# EAGLE design led_driver_3A_flat (EAGLE 6.4)
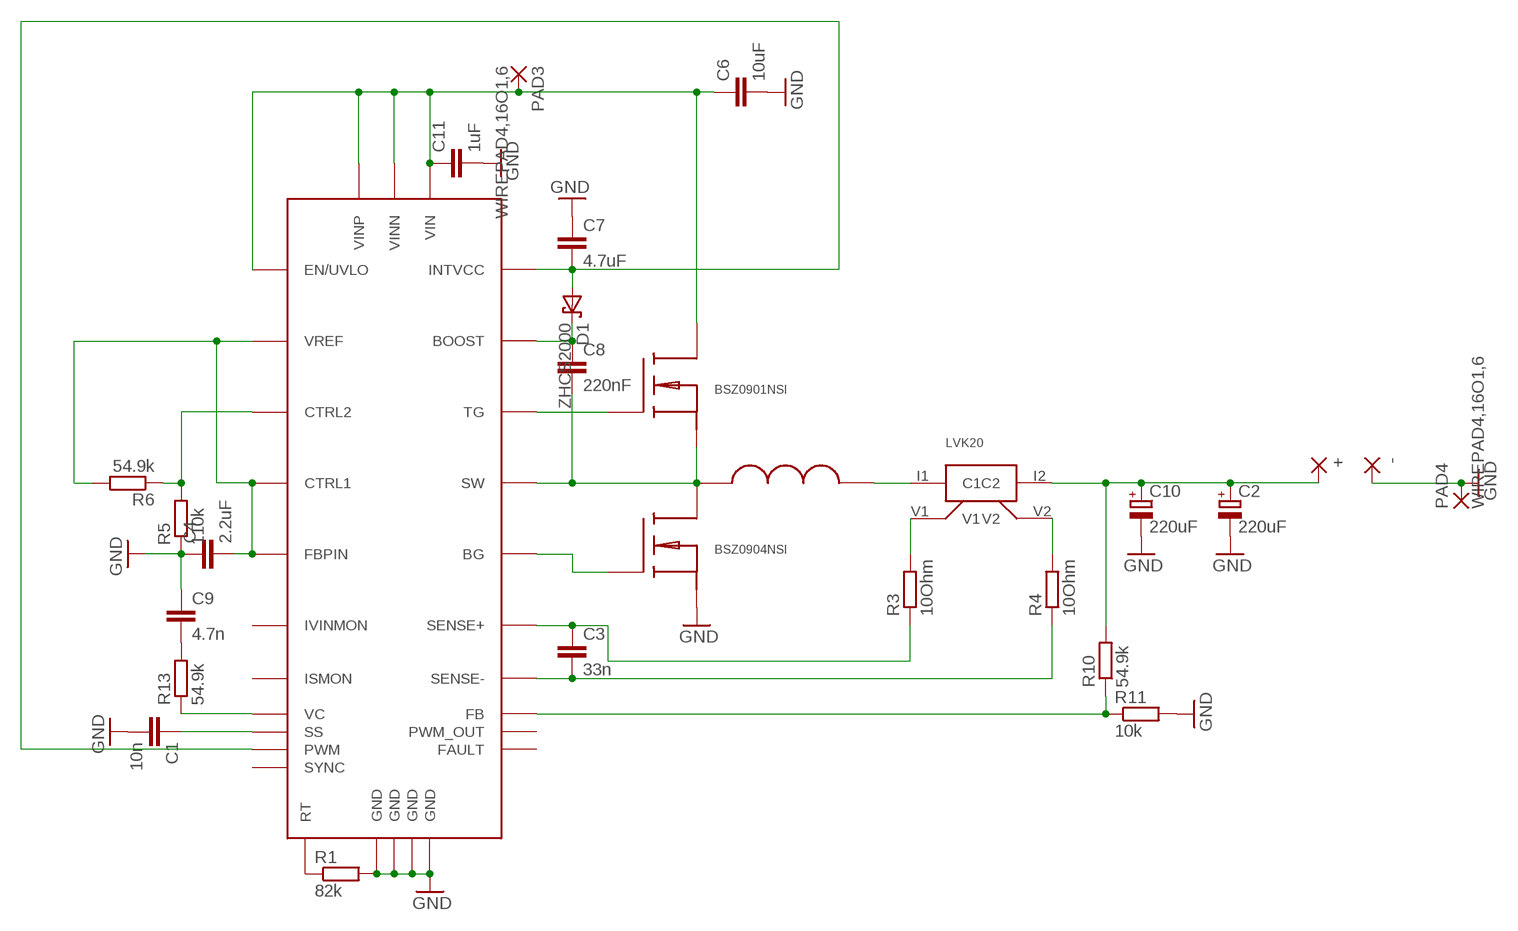
[diagram p0: schematic, sheet 1]

## Parts
+  2,15/1,0  [2,15/1,0]
-  2,15/1,0  [2,15/1,0]
C1  10n  C-EUC0402  [C0402]
C2  220uF  CPOL-EUSMCD  [SMC_D]
C3  33n  C-EUC0402  [C0402]
C4  2.2uF  C-EUC0805  [C0805]
C6  10uF  C-EUC2220K  [C2220K]
C7  4.7uF  C-EUC1206  [C1206]
C8  220nF  C-EUC0603  [C0603]
C9  4.7n  C-EUC0402  [C0402]
C10  220uF  CPOL-EUSMCD  [SMC_D]
C11  1uF  C-EUC1206  [C1206]
D1  ZHCS2000  [SOT23-6]
PAD3  WIREPAD4,16O1,6  [4,16O1,6]
PAD4  WIREPAD4,16O1,6  [4,16O1,6]
R1  82k  R-EU_R0402  [R0402]
R3  10Ohm  R-EU_R0402  [R0402]
R4  10Ohm  R-EU_R0402  [R0402]
R5  110k  R-EU_R0402  [R0402]
R6  54.9k  R-EU_R0402  [R0402]
R10  54.9k  R-EU_R0402  [R0402]
R11  10k  R-EU_R0402  [R0402]
R13  54.9k  R-EU_R0402  [R0402]
U$1  LT3763  [TSSOP-28]
U$2  PG0077  [PG0077]
U$3  BSZ0901NSI  BSZ090X  [BSZ090X]
U$4  BSZ0904NSI  BSZ090X  [BSZ090X]
U$5  LVK20  [LVK20]

## Nets
GND [HI_PWR]: -.1(P) C1.2 C2.- C4.1 C6.2 C7.1 C9.1 C10.- C11.2 PAD4.1(P) R1.2 R5.1 R11.2 U$1.P$12(GND) U$1.P$23(GND) U$1.P$28(GND) U$1.TH(GND) U$4.S@1(S) U$4.S@2(S) U$4.S@3(S) U$4.S@4(S)
N$2 [HI_PWR]: C7.2 D1.3(A) D1.4(A) U$1.P$2(INTVCC) U$1.P$22(PWM)
N$3: C9.2 R13.2
N$4: C4.2 R6.2 U$1.P$5(VREF) U$1.P$10(FBPIN) U$1.P$14(CTRL1)
N$5 [HI_PWR]: +.1(P) C2.+ C10.+ R10.2 U$5.I2(C2)
N$6 [HI_PWR]: R1.1 U$1.P$20(RT)
N$7: R10.1 R11.1 U$1.P$11(FB)
N$8: C1.1 U$1.P$15(SS)
N$9 [HI_PWR]: R13.1 U$1.P$18(VC)
N$12 [HI_PWR]: C8.1 D1.1(K) D1.2(K) D1.5(K) D1.6(K) U$1.P$27(BOOST)
N$13 [AVG_PWR]: C8.2 U$1.P$26(SW) U$2.P$1 U$3.S@1(S) U$3.S@2(S) U$3.S@3(S) U$3.S@4(S) U$4.D U$4.D@1(D) U$4.D@2(D) U$4.D@3(D) U$4.D@4(D)
N$14 [HI_PWR]: R4.2 U$5.V2
N$15 [AVG_PWR]: U$1.P$25(TG) U$3.G
N$16 [AVG_PWR]: U$1.P$1(BG) U$4.G
N$17 [HI_PWR]: C3.1 R3.1 U$1.P$17(SENSE+)
N$18 [HI_PWR]: C3.2 R4.1 U$1.P$16(SENSE-)
N$19 [HI_PWR]: U$2.P$2 U$5.I1(C1)
N$20 [HI_PWR]: R3.2 U$5.V1
N$21: R5.2 R6.1 U$1.P$13(CTRL2)
VIN [HI_PWR]: C6.1 C11.1 PAD3.1(P) U$1.P$3(VIN) U$1.P$4(EN/UVLO) U$1.P$6(VINN) U$1.P$7(VINP) U$3.D U$3.D@1(D) U$3.D@2(D) U$3.D@3(D) U$3.D@4(D)
Unconnected: U$1.P$8(IVINMON) U$1.P$9(FAULT) U$1.P$19(ISMON) U$1.P$21(SYNC) U$1.P$24(PWM_OUT)

## Library data of the parts
+ - = wirepad:2,15/1,0: THROUGH-HOLE PAD
C1 C3 C4 C6-C9 C11 = resistor:C-EU: CAPACITOR, European symbol
C2 C10 = resistor:CPOL-EU: POLARIZED CAPACITOR, European symbol
D1 = zetex:ZHCS2000: SHOTTKY DIODE; MPN: ZHCS2000; OC_FARNELL: 9525653; OC_NEWARK: 98K3992
PAD3 PAD4 = wirepad:WIREPAD: Wire PAD connect wire on PCB
R1 R3-R6 R10 R11 R13 = resistor:R-EU_: RESISTOR, European symbol
U$1 = vsd_custom:LT3763
U$2 = vsd_custom:PG0077
U$3 U$4 = vsd_custom:BSZ090X
U$5 = vsd_custom:LVK20

## Net classes
0 default: width 0.305 mm, drill 0.4 mm
1 AVG_PWR: width 0.381 mm, drill 0.5 mm
2 HI_PWR: width 0.457 mm, drill 0.5 mm

## Board
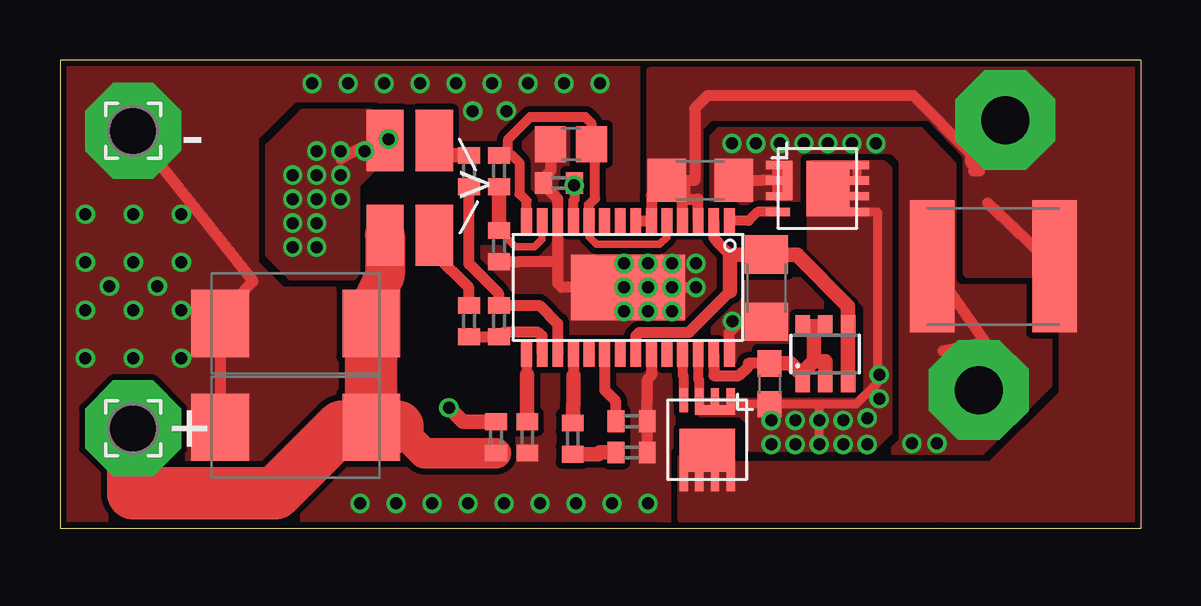
[diagram p1: board, top side]
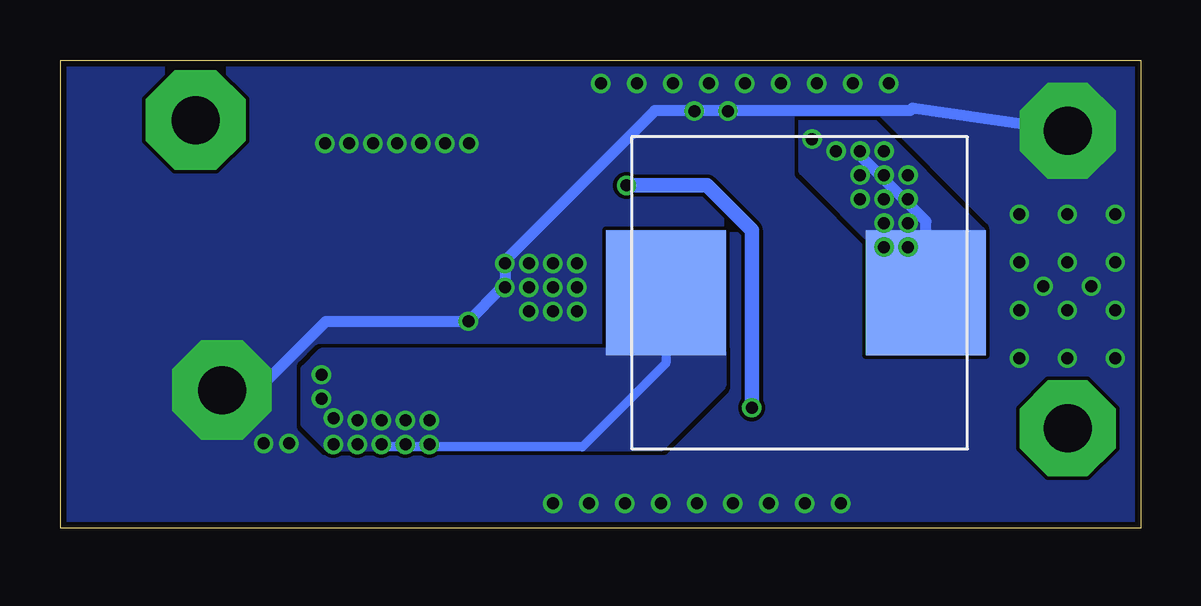
[diagram p2: board, bottom side, seen from below]

Size 45.05 x 19.5 mm. Coordinates in mm from the lower left corner, seen from the top.
Outline: 0,0 36.59,0 45.05,0 45.05,19.5 0,19.5 0,0
Copper layers (1*16): Top 0.035mm / dielectric 1.5mm / Bottom 0.035mm
Design rules "Fusion_eagle_rule_v1.1": minimum track width 6mil, minimum drill 12mil, track to track 6mil, track to pad 6mil, pad to pad 6mil, via to via 6mil, smd to smd 0mil, copper to edge 10mil, drill to drill 10mil, minimum pad ring 10mil, minimum via ring 6mil, stop-mask expansion 2mil, vias tented up to drill 100mil, thermal gap 10mil

### Footprints (pad centres in the part's own frame; a part is rotated, then mirrored left to right if it is on the bottom)
2,15/1,0 = drill 2 pad 4 octagon: 1 0,0
C0402 = smd 0.7 x 0.9: 1 -0.65,0; 2 0.65,0
SMC_D = smd 2.4 x 2.8: + -3.15,0; - 3.15,0
C0805 = smd 1.3 x 1.5: 1 -0.85,0; 2 0.85,0
C2220K = smd 1.85 x 5.5: 1 -2.55,0; 2 2.55,0
C1206 = smd 1.6 x 1.8: 1 -1.4,0; 2 1.4,0
C0603 = smd 1.1 x 1: 1 -0.85,0; 2 0.85,0
SOT23-6 = smd 0.6 x 0.9: 1 -0.95,-1.15; 2 0,-1.15; 3 0.95,-1.15; 4 0.95,1.15; 5 0,1.15; 6 -0.95,1.15
4,16O1,6 = drill 2 pad 4.166 octagon: 1 0,0
R0402 = smd 0.7 x 0.9: 1 -0.65,0; 2 0.65,0
TSSOP-28 = smd 1.05 x 0.45: P$1 -2.775,4.225; P$2 -2.775,3.575; P$3 -2.775,2.925; P$4 -2.775,2.275; P$5 -2.775,1.625; P$6 -2.775,0.975; P$7 -2.775,0.325; P$8 -2.775,-0.325; P$9 -2.775,-0.975; P$10 -2.775,-1.625; P$11 -2.775,-2.275; P$12 -2.775,-2.925; P$13 -2.775,-3.575; P$14 -2.775,-4.225; P$15 2.775,-4.225; P$16 2.775,-3.575; P$17 2.775,-2.925; P$18 2.775,-2.275; P$19 2.775,-1.625; P$20 2.775,-0.975; P$21 2.775,-0.325; P$22 2.775,0.325; P$23 2.775,0.975; P$24 2.775,1.625; P$25 2.775,2.275; P$26 2.775,2.925; P$27 2.775,3.575; P$28 2.775,4.225 | smd 2.74 x 4.75: TH 0,0
PG0077 = smd 5 x 5.2: P$1 -5.575,0; P$2 5.275,0
BSZ090X = smd 1.8 x 2.3: D 0.44,0 | smd 1 x 0.35: D@1 1.65,-0.975; D@2 1.65,-0.325; D@3 1.65,0.325; D@4 1.65,0.975; G -1.65,-0.975; S@2 -1.65,-0.325; S@3 -1.65,0.325; S@4 -1.65,0.975 | smd 0.4 x 1.65: S@1 -1.25,0.325
LVK20 = smd 2.55 x 1.55: I1 -1.975,-1.025; I2 1.975,-1.025; V1 -1.975,1.025; V2 1.975,1.025

### Placement (x,y rotation side)
+  3.05,4.15 0 top
-  3.05,16.55 180 top
C1  19.48,3.77 270 top
C2  9.83,8.53 180 top
C3  18.3,8.62 270 top
C4  21.3,16 0 top
C6  38.9,10.9 180 top
C7  29.45,9.99 90 top
C8  29.57,6.01 270 top
C9  23.82,3.15 180 top
C10  9.83,4.2 180 top
C11  26.69,14.48 0 top
D1  31.9,7.26 0 top
PAD3  39.4,17 0 top
PAD4  38.3,5.75 0 top
R1  23.82,4.45 0 top
R3  17.05,14.88 90 top
R4  17.05,8.62 90 top
R5  18.3,11.75 90 top
R6  18.3,14.88 90 top
R10  18.18,3.77 270 top
R11  20.8,14.38 180 top
R13  21.38,3.73 270 top
U$1  23.68,10.03 270 top
U$2  14.23,9.8 0 bottom
U$3  26.98,3.67 270 top
U$4  31.57,14.15 0 top
U$5  14.58,14.18 270 top

### Tracks (layer width: path | path; a pad name or v marks a point on that pad's centre or on a via)
GND  (via drill 0.5 pad 0.61)
  Top 0.457: v26.51,10.03 26.43,10.03 U$1.TH 20.92,10.03 20.75,10.19 20.75,11.1 | 28.17,8.6 28.15,8.61 v28.03,8.61 | C6.2 38.55,7.76 36.81,7.38 | 29.93,14.48 U$4.S@4 | C10.- C2.- 7.77,10.01 8.05,10.28 -.1 | C9.1 R1.2 24.48,5.28 24.48,6.17 24.65,6.34 U$1.P$23 | 20.75,11.1 U$1.P$12 20.75,13.71 20.15,14.31 R11.2 20.15,14.57 20.45,14.87 C4.1 | 20.75,11.1 19.13,11.1 R5.1 | U$4.S@2 U$4.S@3 | 29.93,14.48 U$4.S@3 | 29.93,14.48 29.27,14.48 C11.2 | C7.1 28.17,8.6 | U$1.P$28 27.9,8.16 28.17,8.43 28.17,8.6 | U$4.S@3 U$4.S@1
  Bottom 0.457: 37.21,4.5 37.27,4.5 37.41,4.64 37.41,5.16 33.96,8.61 v28.03,8.61 26.62,10.03 v26.51,10.03 26.51,11.13 20.25,17.39 9.62,17.39 9.51,17.5 -.1
  other vias: 26.51,11.03 25.51,11.03 24.51,11.03 23.51,11.03 23.51,10.03 25.51,10.03 24.51,10.03 23.51,9.03 24.51,9.03 25.51,9.03 28.01,16.02 29.01,16.02 30.01,16.02 31.01,16.02 32.01,16.02 33.01,16.02 34.01,16.02 35.51,3.52 36.56,3.52 18.61,17.38 17.21,17.38 24.51,1.02 23.01,1.02 21.51,1.02 20.01,1.02 18.51,1.02 17.01,1.02 15.51,1.02 14.01,1.02 12.51,1.02 10.51,18.52 12.01,18.52 13.51,18.52 15.01,18.52 16.51,18.52 18.01,18.52 19.51,18.52 21.01,18.52 22.51,18.52 1.06,13.07 3.06,13.07 5.06,13.07 5.06,11.07 3.06,11.07 1.06,11.07 4.06,10.07 2.06,10.07 3.06,9.07 5.06,9.07 5.06,7.08 3.06,7.08 1.06,7.08 1.06,9.07
  pour Bottom (rank 3, no thermals): 0.25,19.05 49.5,19.1 49.5,0.45 0.25,0.4
  pour Top (isolate 0.25, rank 3, no thermals): 0.3,19.15 0.3,0.5 49.6,0.45 49.65,19.1
N$2
  Top 0.457: 27.93,9.85 26.23,8.16 24.16,8.16 24,8 U$1.P$22 | U$1.P$2 27.25,12.09 27.43,11.89 27.93,11.39 28.17,11.39 | 30.73,11.36 30.73,11.39
  Top 0.61: 27.93,11.39 27.93,9.85 | 28.17,11.39 C7.2 30.73,11.39 | 30.73,11.36 32.85,9.24 D1.4 D1.3
N$3
  Top 0.61: C9.2 22.52,3.15 22.45,3.08 R13.2
N$4
  Top 0.305: U$1.P$5 25.3,12.12 25,11.82 22.37,11.82 22.05,12.14 U$1.P$10
  Top 0.406: 18.68,15.53 18.68,16.2 19.61,17.13 21.89,17.13 22.15,16.87 C4.2 22.15,15.6 22.31,15.45 22.31,13.72 22.21,13.63 22.05,13.47 U$1.P$10 | 18.68,15.53 18.85,15.53 19.16,15.22 19.16,13.93 19.45,13.63 U$1.P$14 | R6.2 18.68,15.53
N$5
  Top 0.457: 12.98,9.32 C2.+
  Top 1.27: 14.08,4.22 15.17,3.12 R10.2
  Top 1.676: 12.98,9.32 13.55,10.54 U$5.I2
  Top 2.184: C2.+ C10.+ 14.08,4.22 11.73,4.22 9.51,2 8.96,1.45 3.05,1.45 +.1
N$6
  Top 0.457: R1.1 23.18,5.28 22.7,5.76 U$1.P$20
N$7  (via drill 0.5 pad 0.61)
  Top 0.305: v21.44,14.27 v21.45,14.27 R11.1
  Top 0.406: v21.45,14.27 21.45,13.68 21.4,13.63 U$1.P$11
  Top 0.61: R10.1 16.8,4.42 v16.21,5.01
  Bottom 0.305: v16.21,5.01
  Bottom 0.61: v21.44,14.27 18.07,14.27 16.21,12.41 v16.21,5.01
N$8
  Top 0.305: 19.45,6.42 19.48,6.39
  Top 0.406: U$1.P$15 19.45,6.42
  Top 0.61: 19.48,6.39 C1.1
N$9
  Top 0.457: U$1.P$18 21.4,6.34
  Top 0.61: R13.1 21.38,5.11 21.4,5.13 21.4,6.34
N$12
  Top 0.457: 30.95,6.32 30.95,6.47 | 30.95,6.53 30.79,6.53 | C8.1 28.69,6.86 28.69,6.73 28.31,6.34 27.25,6.34 U$1.P$27
  Top 0.61: 31.43,6.94 31.9,6.94 D1.2 | 30.95,6.47 31.43,6.94 | 31.43,8.41 D1.5 | D1.6 31.43,8.41 | 31.43,8.41 31.43,6.94 | 30.95,6.53 30.95,6.32 D1.1 | C8.1 30.46,6.86 30.79,6.53
N$13  (via drill 0.5 pad 0.61)
  Top 0.381: 31.65,5.16 C8.2 27.95,5.16 | 31.65,5.16 33.18,5.16 34.07,6.04 34.07,13.18 U$4.D@1 32.38,13.18 32.38,13.49 32.71,13.82 32.8,13.82 | v31.65,3.48 31.65,5.16 | U$3.S@1 26.94,4.92 26.65,4.92 U$3.S@2 | 32.8,13.82 32.38,13.82 32.06,14.15 | U$4.D@2 32.8,13.82 | U$4.D 32.06,14.15 | 32.06,14.15 32.38,14.47 U$4.D@3 U$4.D@4 | 27.95,5.16 27.95,4.9 27.32,4.9 U$3.S@1 | U$3.S@4 27.95,5.16 | U$3.S@1 U$3.S@3
  Top 0.406: U$3.S@2 26.65,6.17 26.6,6.22 U$1.P$26
  Bottom 0.381: v31.65,3.48 31.65,3.38 23.27,3.38 19.8,6.86 U$2.P$1
  other vias: 30.65,3.48 29.65,3.48 29.65,4.48 30.65,4.48 31.65,4.48 32.65,3.48 33.65,3.48 33.65,4.58 32.65,4.48 34.15,5.38 34.15,6.38
  pour Bottom (no thermals): 17.5,7.35 17.5,5.95 20.05,3.4 33.85,3.4 34.8,4.35 34.8,6.6 34.1,7.3 17.55,7.3
  pour Top (no thermals): 26.7,4.85 28.4,4.85 28.8,4.45 28.8,3.4 33.85,3.4 34.49,4.04 34.49,14.91 34.3,15.1 31.35,15.1 31.35,11.65 33.7,9.3 33.7,5.6 33.3,5.2 26.7,5.2
N$14
  Top 0.457: R4.2 17.05,10.01 15.6,11.46 U$5.V2
N$15
  Top 0.406: U$1.P$25 25.95,6.38 26,6.33 U$3.G
N$16
  Top 0.406: U$1.P$1 28.71,12.8 29.08,13.18 U$4.G
N$17
  Top 0.45: 20.75,8.07 20.75,7.61 20.75,7.56
  Top 0.457: R3.1 17.05,11.01 18.05,10.01 18.3,9.76 C3.1 19.13,9.28 19.98,9.28 20.75,8.51 20.75,8.07 | 20.75,7.56 U$1.P$17
N$18
  Top 0.457: U$1.P$16 20.1,7.99 19.94,8.16 18.48,8.16 C3.2 17.88,7.97 R4.1
N$19  (via drill 0.5 pad 0.61)
  Top 0.457: U$5.I1 13.55,15.84 12.58,15.84 11.7,15.38 v11.7,15.71 | v11.7,15.71
  Bottom 0.457: v11.7,15.71 11.7,15.53 8.95,12.78 U$2.P$2
  other vias: 12.7,15.71 11.7,14.71 13.7,16.21 11.7,13.71 10.7,13.71 9.7,13.71 10.7,14.71 9.7,14.71 10.7,15.71 9.7,12.71 10.7,12.71 10.7,11.71 9.7,11.71
  pour Bottom (no thermals): 14,17.15 11.5,17.15 6.7,12.35 6.7,12 7.15,11.55 10.7,11.55 14.05,14.9 14.05,17.1
  pour Top (no thermals): 12.9,17.25 10.15,17.25 8.75,15.85 8.75,11.45 9.65,10.55 12.2,10.55 12.3,10.65 12.3,14.35 12.9,14.95
N$20
  Top 0.457: 16.22,15.53
  Top 0.61: R3.2 16.22,15.53 | U$5.V1 16.22,15.53
N$21
  Top 0.305: U$1.P$13 20.1,12.02 19.79,11.71 18.99,11.71 R5.2
  Top 0.61: R5.2 18.3,13.57 R6.1
VIN
  Top 0.457: 38.09,14.88 38.34,14.88 37.97,15.2 37.97,15.6 35.56,18.01 26.99,18.01 26.47,17.48 26.47,14.48 26.03,14.48 | 26.03,14.48 C11.1 24.65,13.85 U$1.P$6 U$1.P$7 | U$1.P$4 25.95,13.71 26.03,13.71 | 26.03,13.71 26.6,13.71 U$1.P$3 | 26.03,14.48 26.03,13.71 | 38.67,13.54 C6.1
  pour Top (isolate 0.2, rank 2, no thermals): 25.95,2.9 25.95,0.4 49.6,0.4 49.6,19 24.65,19 24.65,13.85 26.6,13.85 26.6,16.7 27.1,17.2 36.25,17.2 37.85,15.55 37.85,10.65 41.4,10.65 41.85,8.45 41.85,5.55 38.75,2.5 38.75,2.55 26.3,2.55

### Text on the board
bValues: V1.2 | LED 3A | IN: 8-25V | OUT: XML or MTG2